# Altium schematic sheet pca63519 - Connectors.SchDoc: PCA63519 - Smart Remote 3 DK shield - Connectors
size A4; DocumentNumber: 1; Revision: 1.2.1; SheetNumber: 1; SheetTotal: 6; DrawnBy: GETR; ProjectNumber: 4414; DocumentSize: A4; PCBRevision: 0049GETR; PCAName: PCA63519; PCBNumber: 400129
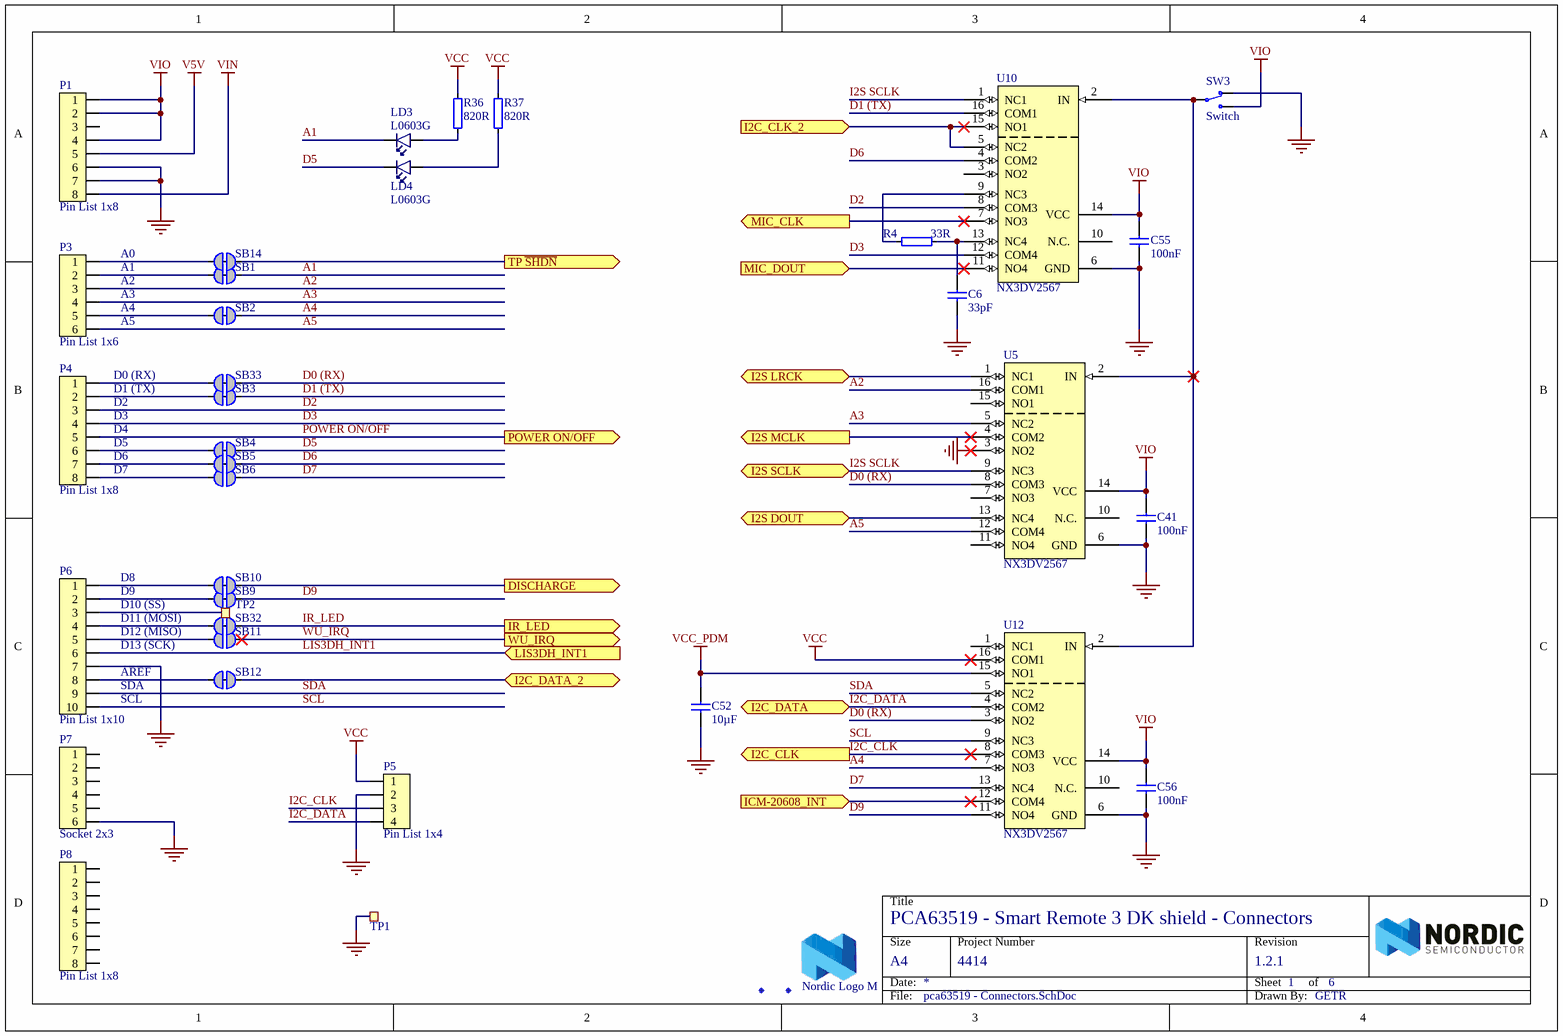
[diagram p0: pca63519 - Connectors.SchDoc]

## Parts
C6  33pF  [CAPC1005X04L]
C41  100nF  [CAPC1005X04L]
C52  10µF  [CAPC1005X04L]
C55  100nF  [CAPC1005X04L]
C56  100nF  [CAPC1005X04L]
Fid1  Fiducial mark  [Fiducial]  (value not drawn)
Fid2  Fiducial mark  [Fiducial]  (value not drawn)
LD3  L0603G  [LED_0603_G]
LD4  L0603G  [LED_0603_G]
LOGO1  Nordic Logo M  [NORDIC_LOGO_M]  (no BOM)
P1  Pin List 1x8  [LIST_1x8_SMD]
P3  Pin List 1x6  [LIST_1x6_SMD]
P4  Pin List 1x8  [LIST_1x8_SMD]
P5  Pin List 1x4  [LIST_1x4]
P6  Pin List 1x10  [LIST_1x10_SMD]
P7  Socket 2x3  [SOCKET_2x3_SMD-2.54mm-bottom]
P8  Pin List 1x8  [LIST_1x8_SMD]
R4  33R  [RESC1005X04L]
R36  820R  [RESC1005X04L]
R37  820R  [RESC1005X04L]
SB1  Solderbridge  [Solderbridge_SHORTED_0.4]  (value not drawn)  (net tie, no BOM)
SB2  Solderbridge  [Solderbridge_SHORTED_0.4]  (value not drawn)  (net tie, no BOM)
SB3  Solderbridge  [Solderbridge_SHORTED_0.4]  (value not drawn)  (net tie, no BOM)
SB4  Solderbridge  [Solderbridge_SHORTED_0.4]  (value not drawn)  (net tie, no BOM)
SB5  Solderbridge  [Solderbridge_SHORTED_0.4]  (value not drawn)  (net tie, no BOM)
SB6  Solderbridge  [Solderbridge_0.4]  (value not drawn)  (no BOM)
SB9  Solderbridge  [Solderbridge_SHORTED_0.4]  (value not drawn)  (net tie, no BOM)
SB10  Solderbridge  [Solderbridge_SHORTED_0.4]  (value not drawn)  (net tie, no BOM)
SB11  Solderbridge  [Solderbridge_0.4]  (value not drawn)  (no BOM)
SB12  Solderbridge  [Solderbridge_SHORTED_0.4]  (value not drawn)  (net tie, no BOM)
SB14  Solderbridge  [Solderbridge_SHORTED_0.4]  (value not drawn)  (net tie, no BOM)
SB32  Solderbridge  [Solderbridge_SHORTED_0.4]  (value not drawn)  (net tie, no BOM)
SB33  Solderbridge  [Solderbridge_SHORTED_0.4]  (value not drawn)  (net tie, no BOM)
SW3  Switch  [CJS-120xA]
TP1  Ø1.0mm,SMD  [TP_SMD_Ø1.0mm]  (value not drawn)  (no BOM)
TP2  Ø1.0mm,SMD  [TP_SMD_Ø1.0mm]  (value not drawn)  (no BOM)
U5  NX3DV2567  [XQFN40P180X260X50-16N]
U10  NX3DV2567  [XQFN40P180X260X50-16N]
U12  NX3DV2567  [XQFN40P180X260X50-16N]

## Ports
DISCHARGE (out), I2C_CLK (out), I2C_CLK_2 (in), I2C_DATA (bidir), I2C_DATA_2 (bidir), I2S DOUT (bidir), I2S LRCK (bidir), I2S MCLK (out), I2S SCLK (bidir), ICM-20608_INT (in), IR_LED (out), LIS3DH_INT1 (in), MIC_CLK (out), MIC_DOUT (in), POWER ON/OFF (out), TP ~{SHDN} (out), WU_IRQ (out)

## Nets
GND: C6.1 C41.1 C52.1 C55.1 C56.1 P1.6 P1.7 P5.2 P6.7 P7.6 SW3.1(N.C) TP1.1 U5.3(NO2) U5.6(GND) U10.6(GND) U12.6(GND)
V5V: P1.5
VCC: P5.1 R36.2 R37.2 U12.16(COM1)
VCC_PDM: C52.2 U12.15(NO1)
VIN: P1.8
VIO: C41.2 C55.2 C56.2 P1.1 P1.2 P1.4 SW3.3(N.O) U5.14(VCC) U10.14(VCC) U12.14(VCC)
A1: LD3.1(C) SB1.1
A2: P3.3 U5.16(COM1)
A3: P3.4 U5.5(NC2)
A4: SB2.1 U12.7(NO3)
A5: P3.6 U5.12(COM4)
D0 (RX): SB33.1 U5.8(COM3) U12.3(NO2)
D1 (TX): SB3.1 U10.16(COM1)
D2: P4.3 U10.8(COM3)
D3: P4.4 U10.12(COM4)
D5: LD4.1(C) SB4.1
D6: SB5.1 U10.4(COM2)
D7: SB6.1 U12.13(NC4)
D9: SB9.1 U12.11(NO4)
DISCHARGE: SB10.1 ; port DISCHARGE
I2C_CLK: P5.3 U12.8(COM3) ; port I2C_CLK
I2C_CLK_2: U10.5(NC2) U10.15(NO1) ; port I2C_CLK_2
I2C_DATA: P5.4 U12.4(COM2) ; port I2C_DATA
I2C_DATA_2: SB12.1 ; port I2C_DATA_2
I2S DOUT: U5.13(NC4) ; port I2S DOUT
I2S LRCK: U5.1(NC1) ; port I2S LRCK
I2S MCLK: U5.4(COM2) ; port I2S MCLK
I2S SCLK: U5.9(NC3) U10.1(NC1) ; port I2S SCLK
ICM-20608_INT: U12.12(COM4) ; port ICM-20608_INT
IR_LED: SB32.1 ; port IR_LED
LIS3DH_INT1: P6.6 ; port LIS3DH_INT1
MIC_CLK: U10.7(NO3) ; port MIC_CLK
MIC_DOUT: U10.11(NO4) ; port MIC_DOUT
POWER ON/OFF: P4.5 ; port POWER ON/OFF
SCL: P6.10 U12.9(NC3)
SDA: P6.9 U12.5(NC2)
TP ~{SHDN}: SB14.1 ; port TP ~{SHDN}
WU_IRQ: SB11.1 ; port WU_IRQ
NetC6_2: C6.2 R4.2 U10.13(NC4)
NetLD3_2: LD3.2(A) R36.1
NetLD4_2: LD4.2(A) R37.1
NetP3_1: P3.1 SB14.2
NetP3_2: P3.2 SB1.2
NetP3_5: P3.5 SB2.2
NetP4_1: P4.1 SB33.2
NetP4_2: P4.2 SB3.2
NetP4_6: P4.6 SB4.2
NetP4_7: P4.7 SB5.2
NetP4_8: P4.8 SB6.2
NetP6_1: P6.1 SB10.2
NetP6_2: P6.2 SB9.2
NetP6_3: P6.3 TP2.1
NetP6_4: P6.4 SB32.2
NetP6_5: P6.5 SB11.2
NetP6_8: P6.8 SB12.2
NetR4_1: R4.1 U10.9(NC3)
NetSW3_2: SW3.2(COM) U5.2(IN) U10.2(IN) U12.2(IN)

Not connected (* = marked no-connect by the designer): P1 3; P7 1 2 3 4 5; P8 1 2 3 4 5 6 7 8; U5 7(NO3) 10(N.C.) 11(NO4) 15(NO1); U10 3(NO2) 10(N.C.); U12 1(NC1) 10(N.C.)

## Notes on the sheet
- (near P3) A0
- (near P3) A1
- (near P3) A2
- (near P3) A3
- (near P3) A4
- (near P4) D0 (RX)
- (near P3) A5
- (near P4) D1 (TX)
- (near P4) D2
- (near P4) D3
- (near P4) D4
- (near P4) D5
- (near P4) D6
- (near P4) D7
- (near P6) D8
- (near P6) D9
- D10 (SS)
- D11 (MOSI)
- D12 (MISO)
- D13 (SCK)
- (near P6) AREF
- (near P6) SDA
- (near P6) SCL
- Title
- Size
- Date:
- Project Number
- Sheet         of
- Revision
- File:
- Drawn By:

## Library data of the parts
C6 = C0402-33p: Capacitor, NP0, ±5%; Note: 50V; Artikkelnr Noca: 20029146; Artikkelnr Simpro: N.A.; Part Number: C0402-33p; Manufacturer: *; Manufacturer Part Number: *; Datasheet: *; Footprint Doc: 0402; LatestRevisionDate: 2009-05-08; Pin Count: 2; Publisher: Nordic Semiconductor; Published: 2009-05-08; Value: 33pF; Supplier: *; Supplier part number: *; 2nd source Supplier: *; 2nd source part number: *
C41 C55 C56 = C0402-100n: Capacitor, X7R, ±10%; Note: 16V; Artikkelnr Noca: 20039200; Artikkelnr Simpro: N.A.; Part Number: C0402-100n; Manufacturer: *; Manufacturer Part Number: *; Datasheet: *; Footprint Doc: 0402; LatestRevisionDate: 2009-11-23; Pin Count: 2; Publisher: Nordic Semiconductor; Published: 2009-05-08; Value: 100nF; Supplier: *; Supplier part number: *; 2nd source Supplier: *; 2nd source part number: *
C52 = C0402-10µF: 10µF ±20% 10V X5R Ceramic Capacitor -55°C ~ 85°C Surface Mount, MLCC 0402; Manufacturer: Samsung; Manufacturer Part Number: CL05A106MP5NUNC; Artikkelnr Noca: N.A.; Part Number: C0402-10µF; Datasheet: http://www.samsungsem.com/kr/support/product-search/mlcc/CL05A106MP5NUNC.jsp; Footprint Doc: 0402; LatestRevisionDate: 2016-04-19; Pin Count: 2; Publisher: Nordic Semiconductor; Published: 2011-01-17; Value: 10µF; Note: 10V; Supplier: Digi-Key; Supplier part number: 1276-1450-1-ND; 2nd source Supplier: *; 2nd source part number: *; Artikkelnr Simpro: N.A.
Fid1 Fid2 = Fid-Mark: Artikkelnr Noca: N.A.; Part Number: Fid-Mark; Manufacturer: *; Manufacturer Part Number: *; Datasheet: *; LatestRevisionDate: 2009-12-12; Pin Count: 1; Publisher: Nordic Semiconductor; Published: 2009-12-12; Value: *; Note: *; Supplier: *; Supplier part number: *; 2nd source Supplier: *; 2nd source part number: *; Footprint Doc: Fiducial; Artikkelnr Simpro: N.A.
LD3 LD4 = LG L29K Smartled Green: LED SMARTLED GREEN 570NM 0603; Manufacturer: Osram; Manufacturer Part Number: LG L29K-G2J1-24-Z; 2nd source part number: 720-LGL29KG2J124Z; Note: 2,24..5.6 mcd, Vfmin=1.7V; Artikkelnr Noca: 13019147; Artikkelnr Simpro: N.A.; Part Number: LG L29K Smartled Green; Datasheet: http://www.osram-os.com/Graphics/XPic2/00077107_0.pdf; Footprint Doc: 0603; LatestRevisionDate: 2016-08-26; Pin Count: 2; Publisher: Nordic Semiconductor; Published: 2014-10-28; Value: L0603G; Supplier: Digi-Key; Supplier part number: 475-2709-1-ND; 2nd source Supplier: Mouser
LOGO1 = Nordic Logo M: Nordic Logo, medium size; Artikkelnr Noca: N.A.; Part Number: Nordic Logo M; Manufacturer: *; Manufacturer Part Number: *; Datasheet: *; LatestRevisionDate: 2010-02-18; Publisher: Nordic Semiconductor; Value: Nordic Logo M; Note: *; Supplier: *; Supplier part number: *; 2nd source Supplier: *; 2nd source part number: *; Pin Count: 2; Published: 2010-02-18; Footprint Doc: NORDIC_LOGO_M; Artikkelnr Simpro: N.A.
P1 P4 P8 = Pin List 1x8 SMD: Pin List 1x8, 2.54mm (100mil), SMD; Manufacturer: W-CON; Manufacturer Part Number: 1125-1108S0M116R2; 2nd source part number: TSM-108-01-L-SV-P-TR; Artikkelnr Noca: 55010006; Artikkelnr Simpro: N.A.; Part Number: Pin List 1x8 SMD; Datasheet: \\hizz\pro\app9717\Datasheet\connectores\W-CON\1125-11XXXXMXXXXX.pdf; LatestRevisionDate: 2016-01-22; Publisher: Nordic Semiconductor; Published: 2016-01-22; Value: Pin List 1x8; Note: *; Supplier: Cabcon; Supplier part number: 1125-1108S0M116R2; 2nd source Supplier: Samtec; Pin Count: 8; Footprint Doc: LIST_1x8_SMD
P3 = Pin List 1x6 SMD: Pin List 1x6, 2.54mm (100mil), SMD; Manufacturer: W-CON; Manufacturer Part Number: 1125-1106S0M116R2; 2nd source part number: TSM-106-01-L-SV-P-TR; Artikkelnr Noca: 55010026; Artikkelnr Simpro: N.A.; Part Number: Pin List 1x6 SMD; Datasheet: \\hizz\pro\app9717\Datasheet\connectores\W-CON\1125-11XXXXMXXXXX.pdf; LatestRevisionDate: 2016-03-29; Pin Count: 6; Publisher: Nordic Semiconductor; Published: 2016-03-29; Value: Pin List 1x6; Note: *; Supplier: Cabcon; Supplier part number: 1125-1106S0M116R2; 2nd source Supplier: Samtec; Footprint Doc: LIST_1x6_SMD
P5 = Pin List 1x4: Pin List 1x4, 2.54mm (100mil); Artikkelnr Noca: 56019092; Artikkelnr Simpro: N.A.; Part Number: Pin List 1x4; Manufacturer: *; Manufacturer Part Number: *; Datasheet: *; Footprint Doc: LIST_1x4; LatestRevisionDate: 2009-12-12; Pin Count: 4; Publisher: Nordic Semiconductor; Published: 2009-12-12; Value: Pin List 1x4; Note: *; Supplier: *; Supplier part number: *; 2nd source Supplier: *; 2nd source part number: *
P6 = Pin List 1x10 SMD: Pin List 1x10, 2.54mm (100mil), SMD; Manufacturer: W-CON; Manufacturer Part Number: 1125-1110S0M116R2; 2nd source part number: TSM-110-01-L-SV-P-TR; Artikkelnr Noca: 55010028; Artikkelnr Simpro: N.A.; Part Number: Pin List 1x10 SMD; Datasheet: \\hizz\pro\app9717\Datasheet\connectores\W-CON\1125-11XXXXMXXXXX.pdf; LatestRevisionDate: 2016-03-29; Publisher: Nordic Semiconductor; Published: 2016-03-29; Value: Pin List 1x10; Note: *; Supplier: Cabcon; Supplier part number: 1125-1110S0M116R2; 2nd source Supplier: Samtec; Pin Count: 10; Footprint Doc: LIST_1x10_SMD
P7 = Socket 2x3 SMD Bottom: Socket 2x3, 2.54mm (100mil), SMD; Manufacturer: W-CON; Manufacturer Part Number: 2171-203MS0CUNR1; 2nd source part number: SSM-103-F-DV-P-TR; Artikkelnr Noca: 55030010; Artikkelnr Simpro: N.A.; Part Number: Socket 2x3 SMD Bottom; Datasheet: \\hizz\pro\app9717\Datasheet\connectores\W-CON\2171-2XXMXXCUNXX.pdf; LatestRevisionDate: 2016-03-29; Pin Count: 6; Publisher: Nordic Semiconductor; Published: 2014-06-10; Value: Socket 2x3; Note: *; Supplier: Cabcon; Supplier part number: 2171-203MS0CUNR1; 2nd source Supplier: Samtec; Footprint Doc: SOCKET_2x3_SMD-2.54mm-bottom
R4 = R0402-33R: Resistor, ±1%, 0.063W; Note: Chip Res 1%; Artikkelnr Noca: 27049037; Artikkelnr Simpro: N.A.; Value Ohm: 33; Part Number: R0402-33R; Manufacturer: *; Manufacturer Part Number: *; Datasheet: *; Footprint Doc: 0402; LatestRevisionDate: 2009-11-23; Pin Count: 2; Publisher: Nordic Semiconductor; Published: 2009-05-08; Value: 33R; Supplier: Farnell; Supplier part number: 173-8830; 2nd source Supplier: *; 2nd source part number: *
R36 R37 = R0402-820: Resistor, ±1%, 0.063W; Note: Chip Res 1%; Artikkelnr Noca: 27049071; Artikkelnr Simpro: N.A.; Value Ohm: 820; Part Number: R0402-820; Manufacturer: *; Manufacturer Part Number: *; Datasheet: *; Footprint Doc: 0402; LatestRevisionDate: 2009-11-23; Pin Count: 2; Publisher: Nordic Semiconductor; Published: 2009-05-08; Value: 820R; Supplier: Farnell; Supplier part number: 173-8849; 2nd source Supplier: *; 2nd source part number: *
SB1-SB5 SB9 SB10 SB12 SB14 SB32 SB33 = Solderbridge Shorted 0.4mm: Shorted Solderbridge; Artikkelnr Noca: N.A.; Part Number: Solderbridge Shorted 0.4mm; Manufacturer: *; Manufacturer Part Number: *; Datasheet: *; Footprint Doc: Solderbridge_Shorted; LatestRevisionDate: 2012-08-07; Pin Count: 2; Publisher: Nordic Semiconductor; Published: 2012-08-07; Value: Solderbridge; Note: *; Supplier: *; Supplier part number: *; 2nd source Supplier: *; 2nd source part number: *; Artikkelnr Simpro: N.A.
SB6 SB11 = Solderbridge 0.4mm: Artikkelnr Noca: N.A.; Part Number: Solderbridge 0.4mm; Manufacturer: *; Manufacturer Part Number: *; Datasheet: *; Footprint Doc: Solderbridge; LatestRevisionDate: 2009-12-14; Pin Count: 2; Publisher: Nordic Semiconductor; Published: 2009-12-14; Value: Solderbridge; Note: *; Supplier: *; Supplier part number: *; 2nd source Supplier: *; 2nd source part number: *; Artikkelnr Simpro: N.A.
SW3 = CJS-1200TA: SMD slide Switch (ON-ON); Manufacturer: Copal Electronics Inc; Artikkelnr Noca: 50019068; Artikkelnr Simpro: N.A.; Part Number: CJS-1200TA; Manufacturer Part Number: CJS-1200TA; Datasheet: http://media.digikey.com/pdf/Data%20Sheets/COPAL%20Electronics%20PDFs/CJS.pdf; LatestRevisionDate: 2012-10-03; Pin Count: 3; Publisher: Nordic Semiconductor; Published: 2012-10-03; Value: Switch; Note: *; Supplier: Digi-Key; Supplier part number: 563-1021-2-ND; 2nd source Supplier: *; 2nd source part number: *; Footprint Doc: CJS-120xA
TP1 TP2 = TP_SMD_Ø1.0MM: 1.0mm circular SMD testpad; Manufacturer: Nordic Semiconductor; Artikkelnr Noca: N.A.; Part Number: TP_SMD_Ø1.0MM; Manufacturer Part Number: *; Datasheet: *; Footprint Doc: TP_SMD_Ø1.0mm; LatestRevisionDate: 2013-06-11; Pin Count: 1; Publisher: Nordic Semiconductor; Published: 2013-06-11; Value: Ø1.0mm,SMD; Note: *; Supplier: *; Supplier part number: *; 2nd source Supplier: *; 2nd source part number: *; Artikkelnr Simpro: N.A.
U5 U10 U12 = NX3DV2567GU: Low-ohmic four-pole double-throw analog switch; Manufacturer: NXP Semiconductors; 2nd source part number: 771-NX3DV2567GU115; Artikkelnr Noca: 15079317; Artikkelnr Simpro: N.A.; Part Number: NX3DV2567GU; Manufacturer Part Number: NX3DV2567GU; Datasheet: http://www.nxp.com/documents/data_sheet/NX3DV2567.pdf; Footprint Doc: XQFN-16; LatestRevisionDate: 2015-02-17; Pin Count: 16; Publisher: Nordic Semiconductor; Published: 2015-02-17; Value: NX3DV2567; Note: *; Supplier: Digi-Key; Supplier part number: 568-5206-1-ND; 2nd source Supplier: Mouser